# EAGLE schematic 1s (EAGLE 9.1.1)
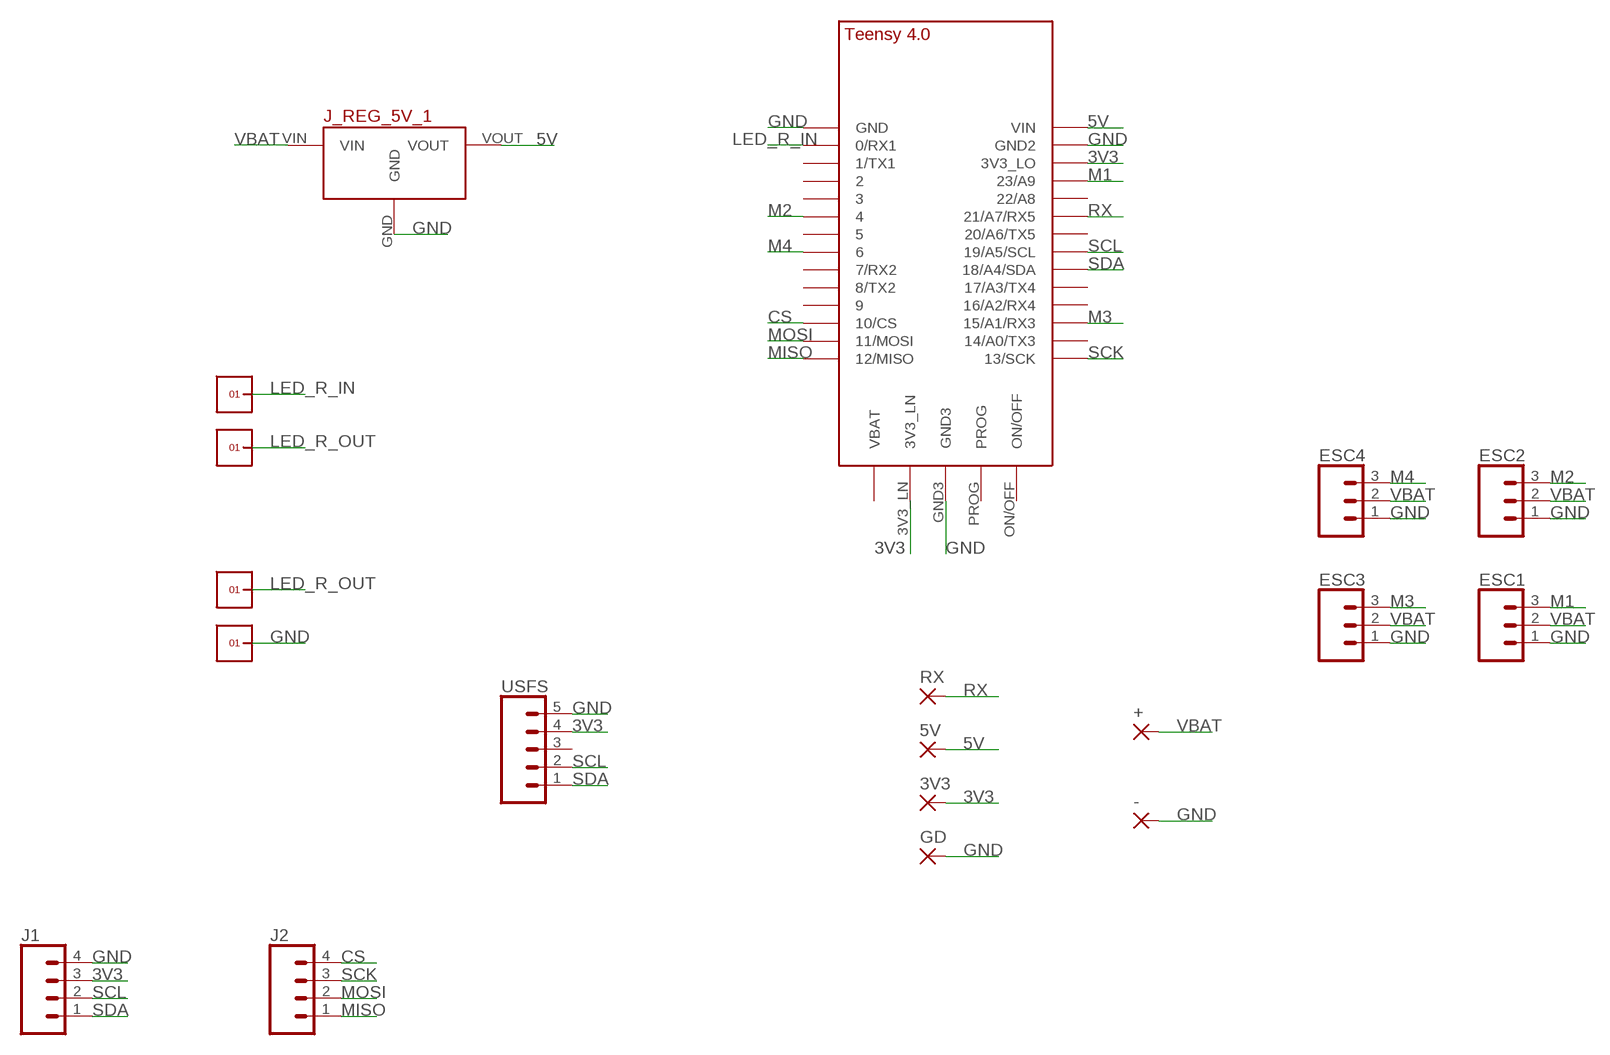
[diagram p0: schematic, sheet 1]

## Parts
3V3  SMD2  [SMD1,27-2,54]
5V  SMD2  [SMD1,27-2,54]
+  SMD5  [SMD2,54-5,08]
-  SMD5  [SMD2,54-5,08]
ESC1  455-1750-1-ND  CONN_03  [1X03]
ESC2  455-1750-1-ND  CONN_03  [1X03]
ESC3  455-1750-1-ND  CONN_03  [1X03]
ESC4  455-1750-1-ND  CONN_03  [1X03]
GD  SMD2  [SMD1,27-2,54]
J1  CONN_041X04_NO_SILK  [1X04_NO_SILK]
J2  CONN_041X04_NO_SILK  [1X04_NO_SILK]
J_REG_5V_1  5V_VOLTAGE_REGULATOR  [5V_VOLTAGE_REGULATOR]
RX  SMD2  [SMD1,27-2,54]
U$1  TEENSY_4.0  [TEENSY_4.0]
U$3  1X1  [1X1]
U$4  1X1  [1X1]
U$6  1X1  [1X1]
U$7  1X1  [1X1]
USFS  CONN_05NO_SILK  [1X05_NO_SILK]

## Nets
3V3: 3V3.1(P) J1.3 U$1.3V3_LN U$1.3V3_LO USFS.4
5V: 5V.1(P) J_REG_5V_1.VOUT U$1.VIN
CS: J2.4 U$1.10/CS
GND: -.1(P) ESC1.1 ESC2.1 ESC3.1 ESC4.1 GD.1(P) J1.4 J_REG_5V_1.GND U$1.GND U$1.GND2 U$1.GND3 U$7.1 USFS.5
LED_R_IN: U$1.0/RX(0/RX1) U$3.1
LED_R_OUT: U$4.1 U$6.1
M1: ESC1.3 U$1.23/A9
M2: ESC2.3 U$1.4/CANRX
M3: ESC3.3 U$1.15/A1(15/A1/RX3)
M4: ESC4.3 U$1.6
MISO: J2.1 U$1.12/MISO
MOSI: J2.2 U$1.11/MOSI
RX: RX.1(P) U$1.21/A7(21/A7/RX5)
SCK: J2.3 U$1.13/SCK
SCL: J1.2 U$1.19/A5/SCL USFS.2
SDA: J1.1 U$1.18/A4/SDA USFS.1
VBAT: +.1(P) ESC1.2 ESC2.2 ESC3.2 ESC4.2 J_REG_5V_1.VIN
Unconnected: U$1.1/TX(1/TX1) U$1.2 U$1.3/CANTX U$1.5 U$1.7(7/RX2) U$1.8(8/TX2) U$1.9/CS U$1.14/A0(14/A0/TX3) U$1.16/A2(16/A2/RX4) U$1.17/A3(17/A3/TX4) U$1.20/A6(20/A6/TX5) U$1.22/A8 U$1.ON/OFF U$1.PROG U$1.VBAT\(VBAT) USFS.3

## Library data of the parts
3V3 5V GD RX = wirepad:SMD2: SMD PAD
+ - = wirepad:SMD5: SMD PAD
ESC1-ESC4 = SparkFun-Connectors:CONN_03: Multi connection point. Often used as Generic Header-pin footprint for 0.1 inch spaced/style header connections On any of the 0.1 inch spaced packages, you can populate with these: Break Away Headers - Straight <https://www.sparkfun.com/products/116> (PRT-00116) Break Away Male Headers - Right Angle <https://www.sparkfun.com/products/553> (PRT-00553) Female Headers <https://www.sparkfun.com/products/115> (PRT-00115) Break Away Headers - Machine Pin <https://www.sparkfun.com/products/117> (PRT-00117) Break Away Female Headers - Swiss Machine Pin <https://www.sparkfun.com/products/743> (PRT-00743) Stackable Header - 3 Pin (Female, 0.1") <https://www.sparkfun.com/products/13875> (PRT-13875) For SCREWTERMINALS and SPRING TERMINALS visit here: Screw Terimnals on SparkFun.com <https://www.sparkfun.com/search/results?term=Screw+Terminals> (5mm/3.5mm/2.54mm spacing) This device is also useful as a general connection point to wire up your design to another part of your project. Our various solder wires solder well into these plated through hole pads. Hook-Up Wire - Assortment (Stranded, 22 AWG) <https://www.sparkfun.com/products/11375> (PRT-11375) Hook-Up Wire - Assortment (Solid Core, 22 AWG) <https://www.sparkfun.com/products/11367> (PRT-11367) View the entire wire category on our website here <https://www.sparkfun.com/categories/141> Special notes: Molex polarized connector foot print use with SKU : PRT-08232 with associated crimp pins and housings.; PROD_ID: XXX-00000
J1 J2 = SparkFun-Connectors:CONN_04: Multi connection point. Often used as Generic Header-pin footprint for 0.1 inch spaced/style header connections On any of the 0.1 inch spaced packages, you can populate with these: Break Away Headers - Straight <https://www.sparkfun.com/products/116> (PRT-00116) Break Away Male Headers - Right Angle <https://www.sparkfun.com/products/553> (PRT-00553) Female Headers <https://www.sparkfun.com/products/115> (PRT-00115) Break Away Headers - Machine Pin <https://www.sparkfun.com/products/117> (PRT-00117) Break Away Female Headers - Swiss Machine Pin <https://www.sparkfun.com/products/743> (PRT-00743) For SCREWTERMINALS and SPRING TERMINALS visit here: Screw Terimnals on SparkFun.com <https://www.sparkfun.com/search/results?term=Screw+Terminals> (5mm/3.5mm/2.54mm spacing) This device is also useful as a general connection point to wire up your design to another part of your project. Our various solder wires solder well into these plated through hole pads. Hook-Up Wire - Assortment (Stranded, 22 AWG) <https://www.sparkfun.com/products/11375> (PRT-11375) Hook-Up Wire - Assortment (Solid Core, 22 AWG) <https://www.sparkfun.com/products/11367> (PRT-11367) View the entire wire category on our website here <https://www.sparkfun.com/categories/141> Special notes: Molex polarized connector foot print use with SKU : PRT-08231 with associated crimp pins and housings. 1MM SMD Version SKU: PRT-10208; PROD_ID: CONN-09696
J_REG_5V_1 = Pololu Voltage Regulators:5V_VOLTAGE_REGULATOR: Polulu 5V Step-Up/Step-Down Voltage REgulator S7V7F5
U$1 = TEENSY 4.0:TEENSY_4.0
U$3 U$4 U$6 U$7 = headers(2mm):1X1
USFS = SparkFun-Connectors:CONN_05: Multi connection point. Often used as Generic Header-pin footprint for 0.1 inch spaced/style header connections On any of the 0.1 inch spaced packages, you can populate with these: Break Away Headers - Straight <https://www.sparkfun.com/products/116> (PRT-00116) Break Away Male Headers - Right Angle <https://www.sparkfun.com/products/553> (PRT-00553) Female Headers <https://www.sparkfun.com/products/115> (PRT-00115) Break Away Headers - Machine Pin <https://www.sparkfun.com/products/117> (PRT-00117) Break Away Female Headers - Swiss Machine Pin <https://www.sparkfun.com/products/743> (PRT-00743) For SCREWTERMINALS and SPRING TERMINALS visit here: Screw Terimnals on SparkFun.com <https://www.sparkfun.com/search/results?term=Screw+Terminals> (5mm/3.5mm/2.54mm spacing) This device is also useful as a general connection point to wire up your design to another part of your project. Our various solder wires solder well into these plated through hole pads. Hook-Up Wire - Assortment (Stranded, 22 AWG) <https://www.sparkfun.com/products/11375> (PRT-11375) Hook-Up Wire - Assortment (Solid Core, 22 AWG) <https://www.sparkfun.com/products/11367> (PRT-11367) View the entire wire category on our website here <https://www.sparkfun.com/categories/141> Special notes: Molex polarized connector foot print use with SKU : PRT-08231 with associated crimp pins and housings. 1MM SMD Version SKU: PRT-10208